# Altium schematic sheet Interface.SchDoc
size A4
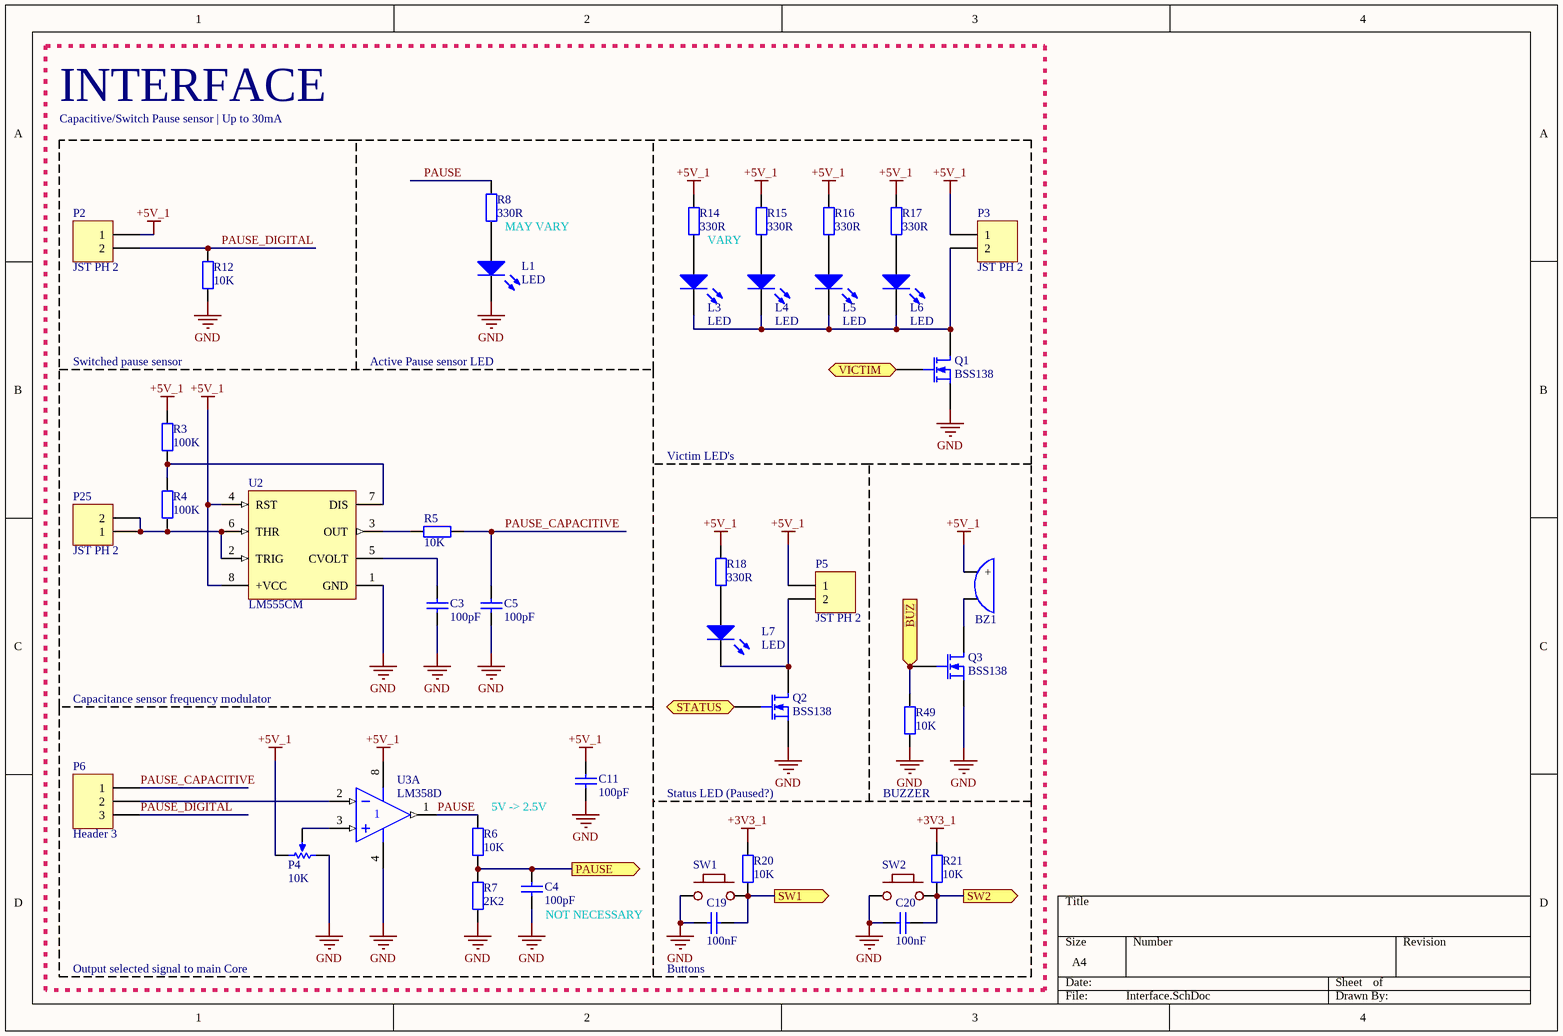
[diagram p0: Interface.SchDoc]

## Parts
BZ1  Buzzer  [BUZZER]  (value not drawn)
C3  100pF  [C0805]
C4  100pF  [C0805]
C5  100pF  [C0805]
C11  100pF  [C0805]
C19  100nF  [6-0805_N]
C20  100nF  [6-0805_N]
L1  LED  [LED0805]
L3  LED  [LED0805]
L4  LED  [LED0805]
L5  LED  [LED0805]
L6  LED  [LED0805]
L7  LED  [LED0805]
P2  JST PH 2  [B2B-PH-K]
P3  JST PH 2  [B2B-PH-K]
P4  10K  [TRIMPOT-3296W]
P5  JST PH 2  [B2B-PH-K]
P6  Header 3  [HDR1X3]
P25  JST PH 2  [B2B-PH-K]
Q1  BSS138  [SOT23]
Q2  BSS138  [SOT23]
Q3  BSS138  [SOT23]
R3  100K  [RES1206]
R4  100K  [RES1206]
R5  10K  [RES1206]
R6  10K  [RES1206]
R7  2K2  [RES1206]
R8  330R  [RES1206]
R12  10K  [RES1206]
R14  330R  [RES1206]
R15  330R  [RES1206]
R16  330R  [RES1206]
R17  330R  [RES1206]
R18  330R  [RES1206]
R20  10K  [RES1206]
R21  10K  [RES1206]
R49  10K  [RES1206]
SW1  PUSH BUTTON  [PUSH-BUTTON 5,2X1,6MM]  (value not drawn)
SW2  PUSH BUTTON  [PUSH-BUTTON 5,2X1,6MM]  (value not drawn)
U2  LM555CM  [M08A_N]
U3  LM358D  [751-02_N]  (part A of 2)

## Ports
BUZ (in), PAUSE (out), STATUS (in), SW1 (out), SW2 (out), VICTIM (in)

## Nets
+3V3_1: R20.1 R21.1
+5V_1: BZ1.1(+) C11.2 P2.1 P3.1 P4.3(BOT) P5.1 R3.2 R14.1 R15.1 R16.1 R17.1 R18.1 U2.4(RST) U2.8(+VCC) U3.8(V+)
GND: C3.1 C4.1 C5.1 C11.1 C19.2 C20.2 L1.2(K) P4.1(TOP) Q1.2(S) Q2.2(S) Q3.2(S) R7.1 R12.1 R49.2 SW1.1 SW2.1 U2.1(GND) U3.4(V-)
BUZ: Q3.3(G) R49.1 ; port BUZ
PAUSE: R6.2 R8.1 U3.1(OUT)
PAUSE: C4.2 R6.1 R7.2 ; port PAUSE  [a separate net that carries the same name]
PAUSE_CAPACITIVE: C5.2 P6.1 R5.1
PAUSE_DIGITAL: P2.2 P6.3 R12.2
STATUS: Q2.3(G) ; port STATUS
SW1: C19.1 R20.2 SW1.2 ; port SW1
SW2: C20.1 R21.2 SW2.2 ; port SW2
VICTIM: Q1.3(G) ; port VICTIM
NetBZ1_2: BZ1.2 Q3.1(D)
NetC3_2: C3.2 U2.5(CVOLT)
NetL1_1: L1.1(A) R8.2
NetL3_1: L3.1(A) R14.2
NetL3_2: L3.2(K) L4.2(K) L5.2(K) L6.2(K) P3.2 Q1.1(D)
NetL4_1: L4.1(A) R15.2
NetL5_1: L5.1(A) R16.2
NetL6_1: L6.1(A) R17.2
NetL7_1: L7.1(A) R18.2
NetL7_2: L7.2(K) P5.2 Q2.1(D)
NetP4_2: P4.2(TAP) U3.3(IN+)
NetP6_2: P6.2 U3.2(IN-)
NetP25_1: P25.1 P25.2 R4.1 U2.2(TRIG) U2.6(THR)
NetR3_1: R3.1 R4.2 U2.7(DIS)
NetR5_2: R5.2 U2.3(OUT)

## Notes on the sheet
- INTERFACE
- Capacitive/Switch Pause sensor | Up to 30mA
- (near R8) MAY VARY
- (near R14) VARY
- Switched pause sensor
- Active Pause sensor LED
- Victim LED's
- Capacitance sensor frequency modulator
- (near R6) 5V -> 2.5V
- Status LED (Paused?)
- BUZZER
- (near C4) NOT NECESSARY
- Output selected signal to main Core
- (near C19) Buttons

## Library data of the parts
C3-C5 C11 C19 C20 = Cap Semi: Capacitor (Semiconductor SIM Model); Published: 8-Jun-2000; LatestRevisionDate: 29-May-2009; LatestRevisionNote: IPC-7351 Footprint Added.; PackageReference: C1206; Publisher: Altium Limited; PackageDescription: Chip Capacitor
  C19 C20: Value: 100nF
P4 = TRIMPOT
P6 = Header 3: Header, 3-Pin; LatestRevisionDate: 17-Jul-2002; LatestRevisionNote: Re-released for DXP Platform.; Publisher: Altium Limited
Q1-Q3 = BSS138: N-Channel Enhancement Mode Vertical DMOS FET; Published: 17-Dec-2003; DatasheetVersion: Mar-96; PackageVersion: 1996; PackageReference: SOT23; Publisher: Altium Limited; PackageDescription: SOT-23; 3 Leads; Body 3.1 x 2.5 mm, inc. leads (LxW max), Alternate Lead Configuration; ComponentLink1Description: Manufacturer Link; ComponentLink1URL: http://www.zetex.com/; ComponentLink2Description: Datasheet; ComponentLink2URL: www.zetex.com/3.0/pdf/BSS138.pdf
R3-R8 R12 R14-R18 R20 R21 R49 = RES
U2 = LM555CM: Timer, 8-pin Narrow SOIC; Manufacturer: National Semiconductor; PackageTopMarking: NSZXTT*LM*555CM; PowerWise: N; CompType: Analog IC; Published: 4-Dec-2008; DatasheetVersion: Jul-2006; PackageVersion: revM, May-2009; PackageReference: M08A; Publisher: Altium Limited; PackageDescription: SOIC Narrow, 4.9 x 3.9 x 1.45mm, 8 Lead, 1.27mm Pitch; Supplier 1: Farnell; Supplier Part Number 1: 9488227; PartNumber: LM555CM; RoHS: N; PinCount: 8; Code_JEDEC: MS-012-AA; Code_IPC: SOIC127P600-8; ComponentLink1Description: LM555 Datasheet; ComponentLink1URL: http://www.national.com/ds/LM/LM555.pdf; ComponentLink2Description: LM555 Web Page; ComponentLink2URL: http://www.national.com/pf/LM/LM555.html; ComponentLink3Description: M08A Package Page; ComponentLink3URL: http://www.national.com/packaging/folders/m08a.html
U3 = LM358D: Dual Low-Power Operational Amplifier; Published: 17-Jul-2002; LatestRevisionDate: 13-Apr-2006; LatestRevisionNote: IPC-7351 Footprint Added.; DatasheetVersion: 1988; PackageReference: 751-02; Publisher: Altium Limited; PackageDescription: 8-Pin Small Outline Integrated Circuit 1.27 mm Pitch; Code_JEDEC: MS-012-AA; Code_IPC: SOIC127P600-8; ComponentLink1Description: Manufacturer Link; ComponentLink1URL: http://www.onsemi.com/site/products/parametrics/0,4446,251,00.html; ComponentLink2Description: Datasheet; ComponentLink2URL: http://www.onsemi.com/pub/Collateral/LM358-D.PDF